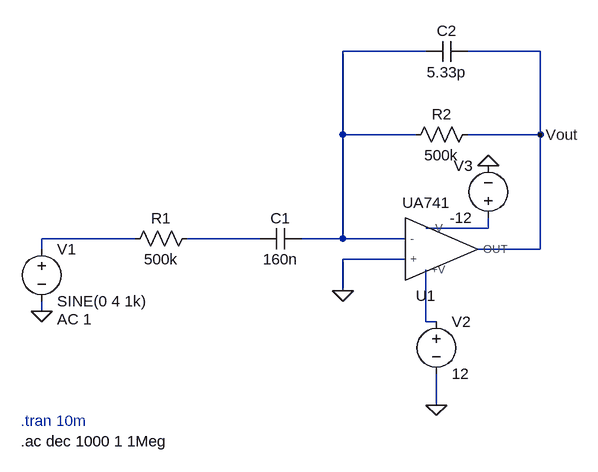
[diagram p0: schematic filter_stage.asc]
filter_stage.asc, the LTspice schematic file:
Version 4
SHEET 1 880 680
WIRE 80 32 -48 32
WIRE 256 32 144 32
WIRE -48 160 -48 32
WIRE 64 160 -48 160
WIRE 256 160 256 32
WIRE 256 160 144 160
WIRE 176 304 176 288
WIRE 176 304 80 304
WIRE -368 320 -512 320
WIRE -176 320 -288 320
WIRE -48 320 -48 160
WIRE -48 320 -112 320
WIRE 48 320 -48 320
WIRE -512 336 -512 320
WIRE 256 336 256 160
WIRE 256 336 160 336
WIRE 48 352 -48 352
WIRE -48 400 -48 352
WIRE -512 432 -512 416
WIRE 80 448 80 368
WIRE 96 448 80 448
WIRE 96 576 96 528
FLAG -48 400 0
FLAG -512 432 0
FLAG 96 576 0
FLAG 176 208 0
FLAG 256 160 Vout
SYMBOL res -272 304 R90
WINDOW 0 0 56 VBottom 2
WINDOW 3 32 56 VTop 2
SYMATTR InstName R1
SYMATTR Value 500k
SYMBOL UA741 80 336 M180
SYMATTR InstName U1
SYMBOL cap -112 304 R90
WINDOW 0 0 32 VBottom 2
WINDOW 3 32 32 VTop 2
SYMATTR InstName C1
SYMATTR Value 160n
SYMBOL res 160 144 R90
WINDOW 0 0 56 VBottom 2
WINDOW 3 32 56 VTop 2
SYMATTR InstName R2
SYMATTR Value 500k
SYMBOL cap 144 16 R90
WINDOW 0 0 32 VBottom 2
WINDOW 3 32 32 VTop 2
SYMATTR InstName C2
SYMATTR Value 5.33p
SYMBOL voltage -512 320 R0
WINDOW 123 24 124 Left 2
WINDOW 39 0 0 Left 0
SYMATTR Value2 AC 1
SYMATTR InstName V1
SYMATTR Value SINE(0 4 1k)
SYMBOL voltage 96 432 R0
WINDOW 123 0 0 Left 0
WINDOW 39 0 0 Left 0
SYMATTR InstName V2
SYMATTR Value 12
SYMBOL voltage 176 304 R180
WINDOW 0 24 96 Left 2
WINDOW 3 24 16 Left 2
WINDOW 123 0 0 Left 0
WINDOW 39 0 0 Left 0
SYMATTR InstName V3
SYMATTR Value -12
TEXT -544 600 Left 2 ;.tran 10m
TEXT -544 632 Left 2 !.ac dec 1000 1 1Meg

The netlist it stands for:
* filter_stage.asc
R1 N004 N003 500k
XU1 0 N001 N005 N002 Vout UA741  ; pins + - +V -V OUT
C1 N001 N004 160n
R2 Vout N001 500k
C2 Vout N001 5.33p
V1 N003 0 SINE(0 4 1k) AC 1
V2 N005 0 12
V3 N002 0 -12
* .tran 10m
.ac dec 1000 1 1Meg
.lib D:\Sem_2\AEC\Subcircuit for Lab 8 Prelab.txt
.backanno
.end